# Altium schematic sheet Electric_schematic.SchDoc
size A4; SheetNumber: 1; SheetTotal: 1
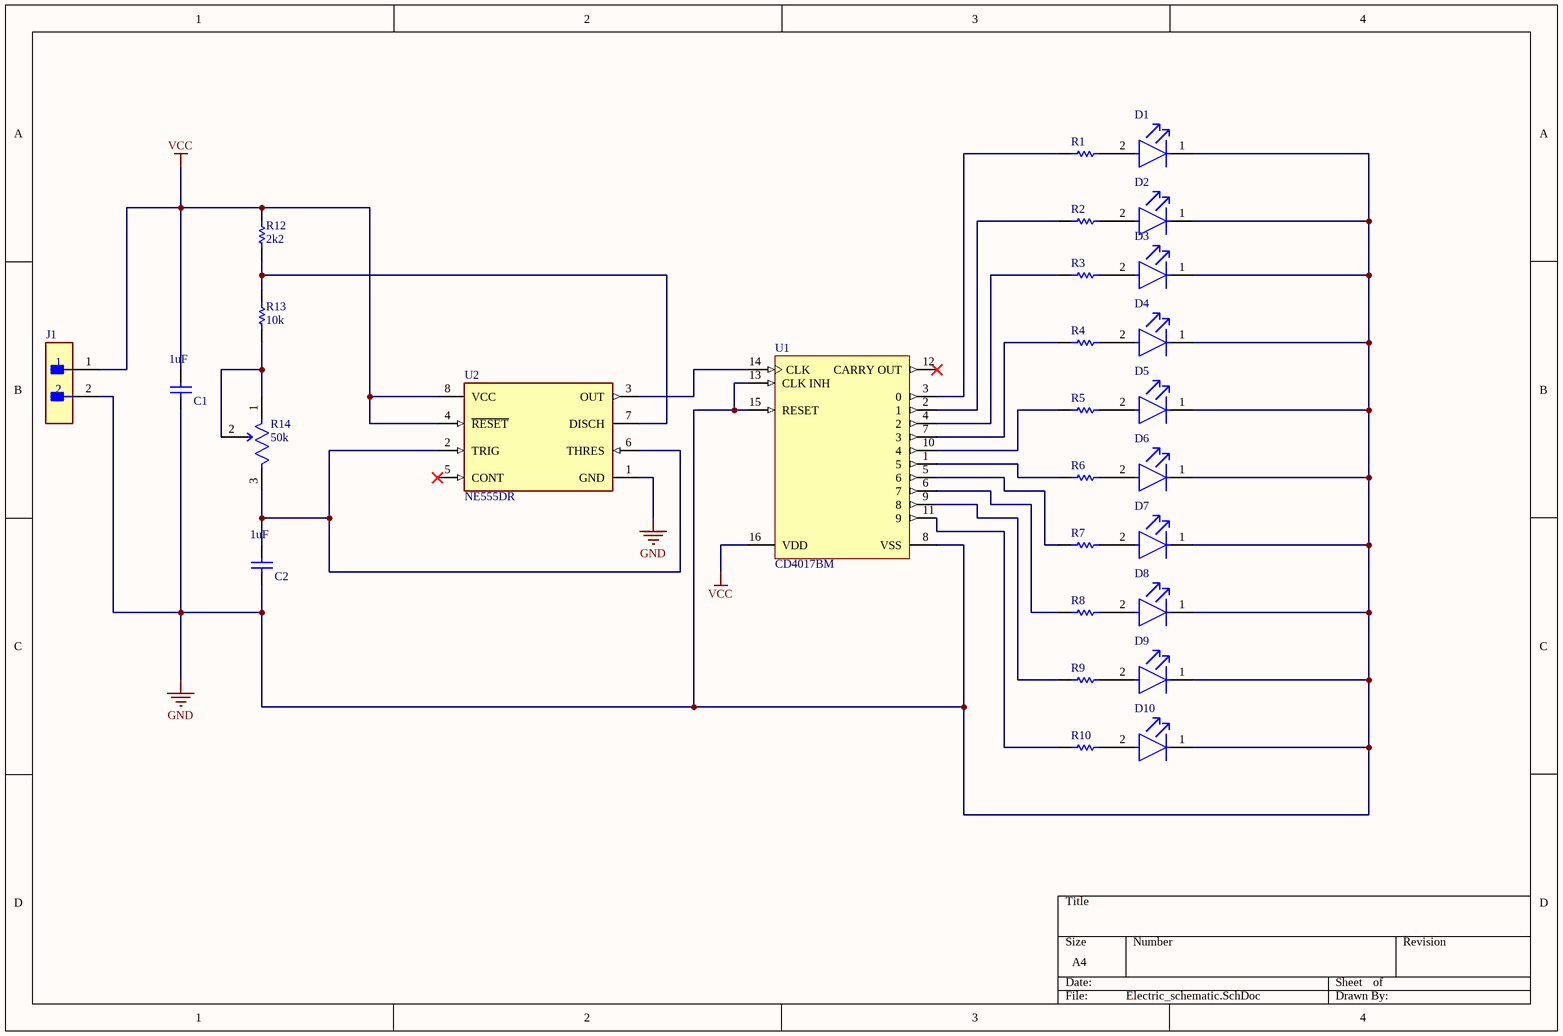
[diagram p0: Electric_schematic.SchDoc]

## Parts
C1  1uF  [CAPC2013X135X45LL10T25]
C2  1uF  [CAPC2013X135X45LL10T25]
D1  HLMP-1301  [FP-HLMP-1301-MFG]  (value not drawn)
D2  HLMP-1301  [FP-HLMP-1301-MFG]  (value not drawn)
D3  HLMP-1301  [FP-HLMP-1301-MFG]  (value not drawn)
D4  HLMP-1301  [FP-HLMP-1301-MFG]  (value not drawn)
D5  HLMP-1301  [FP-HLMP-1301-MFG]  (value not drawn)
D6  HLMP-1301  [FP-HLMP-1301-MFG]  (value not drawn)
D7  HLMP-1301  [FP-HLMP-1301-MFG]  (value not drawn)
D8  HLMP-1301  [FP-HLMP-1301-MFG]  (value not drawn)
D9  HLMP-1301  [FP-HLMP-1301-MFG]  (value not drawn)
D10  HLMP-1301  [FP-HLMP-1301-MFG]  (value not drawn)
J1  M20-9990246  [FP-M20-9990246-MFG]  (value not drawn)
R1  RC0805FR-071KL  [RESC2013X60X35ML10T20]  (value not drawn)
R2  RC0805FR-071KL  [RESC2013X60X35ML10T20]  (value not drawn)
R3  RC0805FR-071KL  [RESC2013X60X35ML10T20]  (value not drawn)
R4  RC0805FR-071KL  [RESC2013X60X35ML10T20]  (value not drawn)
R5  RC0805FR-071KL  [RESC2013X60X35ML10T20]  (value not drawn)
R6  RC0805FR-071KL  [RESC2013X60X35ML10T20]  (value not drawn)
R7  RC0805FR-071KL  [RESC2013X60X35ML10T20]  (value not drawn)
R8  RC0805FR-071KL  [RESC2013X60X35ML10T20]  (value not drawn)
R9  RC0805FR-071KL  [RESC2013X60X35ML10T20]  (value not drawn)
R10  RC0805FR-071KL  [RESC2013X60X35ML10T20]  (value not drawn)
R12  2k2  [RESC2013X60X35ML10T20]
R13  10k  [RESC2013X60X35ML10T20]
R14  50k  [FP-3386P-MFG]
U1  CD4017BM  [D0016A_N]
U2  NE555DR  [FP-D0008A-IPC_A]

## Nets
GND: C1.2 C2.2 D1.1(C) D2.1(C) D3.1(C) D4.1(C) D5.1(C) D6.1(C) D7.1(C) D8.1(C) D9.1(C) D10.1(C) J1.2 U1.8(VSS) U1.13(CLK_INH) U1.15(RESET) U2.1(GND)
VCC: C1.1 J1.1 R12.2 U1.16(VDD) U2.4(~{RESET}) U2.8(VCC)
NetC2_1: C2.1 R14.3(CW) U2.2(TRIG) U2.6(THRES)
NetD1_2: D1.2(A) R1.2
NetD2_2: D2.2(A) R2.2
NetD3_2: D3.2(A) R3.2
NetD4_2: D4.2(A) R4.2
NetD5_2: D5.2(A) R5.2
NetD6_2: D6.2(A) R6.2
NetD7_2: D7.2(A) R7.2
NetD8_2: D8.2(A) R8.2
NetD9_2: D9.2(A) R9.2
NetD10_2: D10.2(A) R10.2
NetR1_1: R1.1 U1.3(0)
NetR2_1: R2.1 U1.2(1)
NetR3_1: R3.1 U1.4(2)
NetR4_1: R4.1 U1.7(3)
NetR5_1: R5.1 U1.10(4)
NetR6_1: R6.1 U1.1(5)
NetR7_1: R7.1 U1.5(6)
NetR8_1: R8.1 U1.6(7)
NetR9_1: R9.1 U1.9(8)
NetR10_1: R10.1 U1.11(9)
NetR12_1: R12.1 R13.2 U2.7(DISCH)
NetR13_1: R13.1 R14.1(CCW) R14.2(WIPER)
NetU1_14: U1.14(CLK) U2.3(OUT)

Not connected (* = marked no-connect by the designer): U1 12(CARRY_OUT)*; U2 5(CONT)*

## Library data of the parts
C1 C2 = CMP-1036-04761-2: Manufacturer: Murata; Part Number: GRM21BR71H105KA12L
D1-D10 = CMP-18399-000007-1: LED RED DIFFUSED T-1 T/H; Manufacturer: Broadcom; Forward Current: 10mA; Max Junction Temp: +110°C; Wavelength: 626nm; Led Orientation: Straight; Viewing Angle: 60°; Luminous Intensity: 3.4mcd; Forward Voltage: 1.9V; Reverse Voltage: 5V; Peak Emmision Wavelength: 635nm; Mouser Description: Standard LEDs - Through Hole Red Diffused 635nm 3.4mcd; RoHS: TRUE; ComponentLink2Description: Datasheet; Device Class L1: Optoelectronics; Temperature Range High: +100°C; Manufacturer Part Number: HLMP-1301; ComponentLink2URL: https://docs.broadcom.com/docs/AV02-1555EN; Colour: Red; Digikey Description: LED RED DIFFUSED T-1 T/H; Automotive: No; Device Class L2: LEDs; Temperature Range Low: -40°C; Octopart: https://octopart.com/hlmp-1301-broadcom-71130345; Category: Diode; Lead Free: Yes; Device Class L3: unset; Package: 0; Temperature: -40°C to +100°C
J1 = CMP-15831-000009-1: CONN HEADER VERT 2POS 2.54MM; Manufacturer: Harwin; Conn Gender: Male; Conn Orientation: Vertical; Number Of Contacts: 2; Current Rating: 3A; ComponentLink2URL: https://cdn.harwin.com/pdfs/M20-999.pdf; ComponentLink2Description: Datasheet; Package: M20-9990246; Temperature: -40°C to +105°C; Octopart: https://octopart.com/m20-9990246-harwin-2590635; Mouser Description: 2.54mm (0.1") Pitch SIL Vertical PC Tail Pin Header, 6.1mm mating pin height, tin, 2 contacts; Temperature Range High: +105°C; Device Class L1: Connectors; RoHS: TRUE; Automotive: No; Height: 8.99mm; Number Of Rows: 1; Contact Material: Tin,Nickel; Category: Conn; Pitch: 2.54mm; Lead Free: Yes; Digikey Description: CONN HEADER VERT 2POS 2.54MM; Manufacturer Part Number: M20-9990246; Temperature Range Low: -40°C; Device Class L3: unset; Device Class L2: Headers and Wire Housings
R1-R10 R12 R13 = CMP-2100-03671-1: Chip Resistor, 1 KOhm, +/- 1%, 125 mW, -55 to 155 degC, 0805 (2012 Metric), RoHS, Tape and Reel; Manufacturer: Yageo; Temperature Coefficient: 100ppm/degreesC; Voltage Rating (DC): 150V; Max Power Dissipation: 125mW; Resistance: 1KOhm; Number of Pins: 2; Number of Terminations: 2; Datasheet URL: http://www.yageo.com/NewPortal/yageodocoutput?fileName=/pdf/R-Chip/PYu-RC_Group_51_RoHS_L_5.pdf; Length: 0.079inch; Package Description: 2-Pin Surface Mounted Device, Body 2 x 1.25 mm; Depth: 1.25mm; Height: 0.024inch; Military Standard: Not; Case/Package: 0805; Package Reference: 0805; RoHSCompliant: true; Lead Free: LeadFree; Packaging: TapeandReel; Package Quantity: 1; Datasheet Version: Rev. 5, 10/2016; Tolerance: 1%; Min Operating Temperature: -55degC; Voltage Rating: 150V; Composition: ThickFilm; Case Code (Imperial): 0805; Power Rating: 125mW; Width: 0.049inch; Case Code (Metric): 2012; Manufacturer URL: http://www.yageo.com/; Max Operating Temperature: 155degC; REACH SVHC: Unknown; Termination: SMD/SMT
R14 = CMP-2000-05592-8: TRIMMER 100K OHM 0.5W PC PIN TOP; Manufacturer Series: 3386; Resistance Law: Linear; Voltage Rating: 300V; Actuator Orientation: Vertical; Tolerance: 10%; Number of Turns: 1; Resistance: 100kR; Number of Terminals/Pins: 3; Temperature Coefficient: 100ppm/°C; Max Power Dissipation: 500mW; Actuator Type: SCREW; Radiation Hardening: No; Package Quantity: 100; Type: Potentiometer; Contact Plating: Tin; RoHS Compliant: Yes; Depth: 9.53mm; Terminal Finish: Tin; Taper: Linear; Color: Blue; Number of Pins: 3; Width: 9.53mm; Lead Free: Contains Lead; Reach SVHC Compliant: Yes; Packaging: Rail/Tube; Min Operating Temperature: -55°C; Max Operating Temperature: 125°C; Technology: CERMET; Height: 4.83mm; Series: Trimpot® 3386 - Sealed; Termination: Pin; Resistance Tolerance: 10%; Power Rating: 500mW; Resistor Type: Cermet; Mount: Through Hole; Military Standard: Not; Length: 9.53mm; Weight: 0.03oz
U1 = CMP-1623-00071-2: CMOS Decade Counter with 10 Decoded Outputs, D0016A, TUBE; Manufacturer: Texas Instruments; Voltage(Nom)(V): 10; VCC(Min)(V): 3; tpd @ Nom Voltage(Max)(ns): 270; Technology Family: CD4000; VCC(Max)(V): 18; ICC @ Nom Voltage(Max)(mA): 0.03; Schmitt Trigger: No; Inputs: 1; Rating: Military; F @ Nom Voltage(Max)(Mhz): 8; Output Drive (IOL/IOH)(Max)(mA): 1.5/-1.5; Generic Part Number: CD4017B; DatasheetVersion: SCHS027C; Type: Decade; PackageReference: D0016A; Operating Temperature Range(C): -55 to 125; Function: Counter; Bits(#): 10; Code_JEDEC: MS-012 variation AC; Output Type: CMOS; Input Type: CMOS
U2 = CMP-1685-00007-2: IC OSC SGL TIMER 100KHZ 8-SOIC; Low Level Output Current: 200mA; Quiescent Current: 15mA; Min Supply Voltage: 4.5V; Number of Timers/Counters: 1; Max Supply Voltage: 16V; Operating Supply Current: 10mA; High Level Output Current: -200mA; Packaging: Tape and Reel; Frequency: 100kHz; Weight: 0.002561oz; REACH SVHC: No SVHC; Package Quantity: 2500; Width: 3.91mm; Max Operating Temperature: 70°C; Contact Plating: Gold; Lead Free: Lead Free; Number of Pins: 8; Min Operating Temperature: 0°C; Radiation Hardening: No; Length: 4.9mm; Case/Package: SOIC; Height: 1.58mm; Mount: Surface Mount